# EAGLE design teclado_at_f340_smd_v2 (EAGLE 7.2.0)
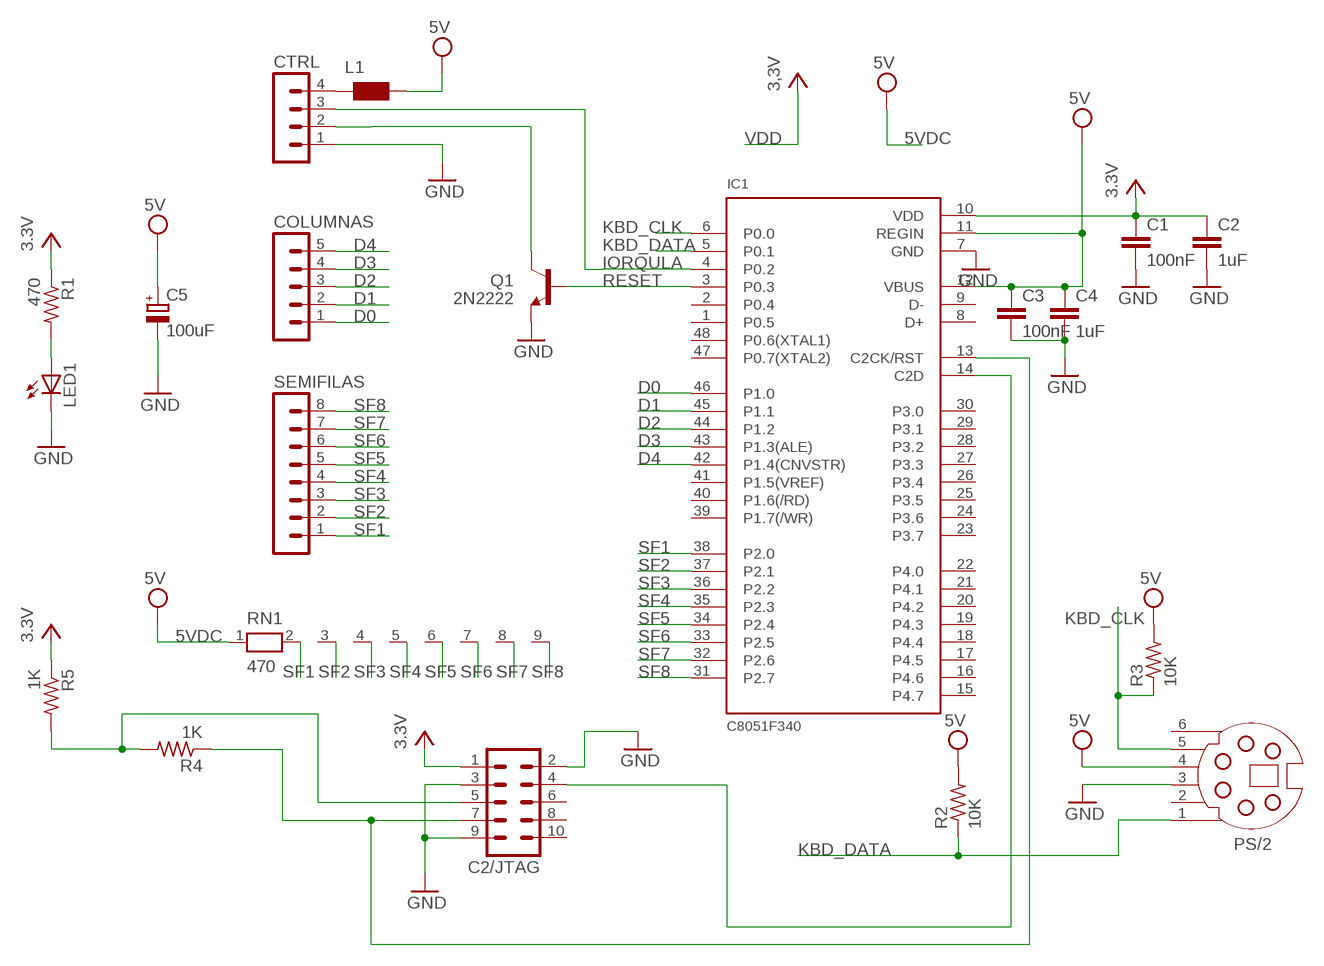
[diagram p0: schematic, sheet 1]

## Parts
C1  100nF  C-EUC0805K  [C0805K]
C2  1uF  C-EUC0805K  [C0805K]
C2/JTAG  MA05-2  [MA05-2]
C3  100nF  C-EUC0805K  [C0805K]
C4  1uF  C-EUC0805K  [C0805K]
C5  100uF  CPOL-EUE2,5-6E  [E2,5-6E]
COLUMNAS  MA05-1  [MA05-1]
CTRL  MA04-1  [MA04-1]
IC1  C8051F340  [TQFP48]
L1  WE-CBF_0805  [0805]
LED1  LEDCHIP-LED0805  [CHIP-LED0805]
PS/2  SSV-G06  [SSV-BC06]
Q1  2N2222  TRANSISTOR_NPNSOT23-3  [SOT23-3]
R1  470  R-US_M0805  [M0805]
R2  10K  R-US_M0805  [M0805]
R3  10K  R-US_M0805  [M0805]
R4  1K  R-US_M0805  [M0805]
R5  1K  R-US_M0805  [M0805]
RN1  470  RN08  [RN-9]
SEMIFILAS  MA08-1  [MA08-1]

## Nets
5VDC [power]: C3.1 C4.1 C5.+ IC1.11(REGIN) IC1.12(VBUS) L1.2 PS/2.4 R2.2 R3.2 RN1.1 ; supply symbol labelled 5V
D0: COLUMNAS.1 IC1.46(P1.0)
D1: COLUMNAS.2 IC1.45(P1.1)
D2: COLUMNAS.3 IC1.44(P1.2)
D3: COLUMNAS.4 IC1.43(P1.3(ALE))
D4: COLUMNAS.5 IC1.42(P1.4(CNVSTR))
GND [power]: C1.2 C2.2 C2/JTAG.2 C2/JTAG.3 C2/JTAG.9 C3.2 C4.2 C5.- CTRL.1 IC1.7(GND) LED1.C PS/2.3 Q1.2(E)
IORQULA: CTRL.3 IC1.4(P0.2)
KBD_CLK: IC1.6(P0.0) PS/2.5 R3.1
KBD_DATA: IC1.5(P0.1) PS/2.1 R2.1
N$1: C2/JTAG.7 IC1.13(C2CK/RST) R4.1
N$2: LED1.A R1.2
N$3: C2/JTAG.5 R4.2 R5.2
N$4: C2/JTAG.4 IC1.14(C2D)
N$5: CTRL.4 L1.1
N$7: CTRL.2 Q1.3(C)
RESET: IC1.3(P0.3) Q1.1(B)
SF1: IC1.38(P2.0) RN1.2 SEMIFILAS.1
SF2: IC1.37(P2.1) RN1.3 SEMIFILAS.2
SF3: IC1.36(P2.2) RN1.4 SEMIFILAS.3
SF4: IC1.35(P2.3) RN1.5 SEMIFILAS.4
SF5: IC1.34(P2.4) RN1.6 SEMIFILAS.5
SF6: IC1.33(P2.5) RN1.7 SEMIFILAS.6
SF7: IC1.32(P2.6) RN1.8 SEMIFILAS.7
SF8: IC1.31(P2.7) RN1.9 SEMIFILAS.8
VDD [power]: C1.1 C2.1 C2/JTAG.1 IC1.10(VDD) R1.1 R5.1 ; supply symbol labelled 3,3V, 3.3V
Unconnected: C2/JTAG.6 C2/JTAG.8 C2/JTAG.10 IC1.1(P0.5) IC1.2(P0.4) IC1.8(D+) IC1.9(D-) IC1.15(P4.7) IC1.16(P4.6) IC1.17(P4.5) IC1.18(P4.4) IC1.19(P4.3) IC1.20(P4.2) IC1.21(P4.1) IC1.22(P4.0) IC1.23(P3.7) IC1.24(P3.6) IC1.25(P3.5) IC1.26(P3.4) IC1.27(P3.3) IC1.28(P3.2) IC1.29(P3.1) IC1.30(P3.0) IC1.39(P1.7(/WR)) IC1.40(P1.6(/RD)) IC1.41(P1.5(VREF)) IC1.47(P0.7(XTAL2)) IC1.48(P0.6(XTAL1)) PS/2.2 PS/2.6

## Library data of the parts
C1-C4 = rcl:C-EU: CAPACITOR, European symbol
C2/JTAG = con-lstb:MA05-2: PIN HEADER
C5 = rcl:CPOL-EU: POLARIZED CAPACITOR, European symbol
COLUMNAS = con-lstb:MA05-1: PIN HEADER
CTRL = con-lstb:MA04-1: PIN HEADER
IC1 = silabs-2:C8051F340: Full Speed USB Flash MCU
L1 = wuerth-elektronik:WE-CBF: SMD EMI Suppression Ferrite Beads - excellent anti-EMI properties - low DCR - impedances till 3000 ohms - rated current up to 6 A
LED1 = adafruit:LED: LED OSRAM: - CHIPLED LG R971, LG N971, LY N971, LG Q971, LY Q971, LO R971, LY R971 LH N974, LH R974 LS Q976, LO Q976, LY Q976 LO Q996 - Hyper CHIPLED LW Q18S LB Q993, LB Q99A, LB R99A - SideLED LS A670, LO A670, LY A670, LG A670, LP A670 LB A673, LV A673, LT A673, LW A673 LH A674 LY A675 LS A676, LA A676, LO A676, LY A676, LW A676 LS A679, LY A679, LG A679 - Hyper Micro SIDELED® LS Y876, LA Y876, LO Y876, LY Y876 LT Y87S - SmartLED LW L88C, LW L88S LB L89C, LB L89S, LG L890 LS L89K, LO L89K, LY L89K LS L896, LA L896, LO L896, LY L896 - TOPLED LS T670, LO T670, LY T670, LG T670, LP T670 LSG T670, LSP T670, LSY T670, LOP T670, LYG T670 LG T671, LOG T671, LSG T671 LB T673, LV T673, LT T673, LW T673 LH T674 LS T676, LA T676, LO T676, LY T676, LB T676, LH T676, LSB T676, LW T676 LB T67C, LV T67C, LT T67C, LS T67K, LO T67K, LY T67K, LW E67C LS E67B, LA E67B, LO E67B, LY E67B, LB E67C, LV E67C, LT E67C LW T67C LS T679, LY T679, LG T679 LS T770, LO T770, LY T770, LG T770, LP T770 LB T773, LV T773, LT T773, LW T773 LH T774 LS E675, LA E675, LY E675, LS T675 LS T776, LA T776, LO T776, LY T776, LB T776 LHGB T686 LT T68C, LB T68C - Hyper Mini TOPLED® LB M676 - Mini TOPLED Santana® LG M470 LS M47K, LO M47K, LY M47K Source: http://www.osram.convergy.de/
PS/2 = con-yamaichi:SSV-G06: YAMAICHI CONNECTOR
Q1 = SparkFun:TRANSISTOR_NPN: Transistor NPN BJT configuration in SOT23 package. MMBT2222 is the common NPN we use. Double check BCE configuration again layout.
R1-R5 = rcl:R-US_: RESISTOR, American symbol
RN1 = resistor-net:RN08: RESISTOR NETWORK
SEMIFILAS = con-lstb:MA08-1: PIN HEADER

## Net classes
0 default: width 0.254 mm, clearance 0.254 mm
1 power: width 0.508 mm, clearance 0.254 mm to class 0, clearance 0.254 mm

## Board
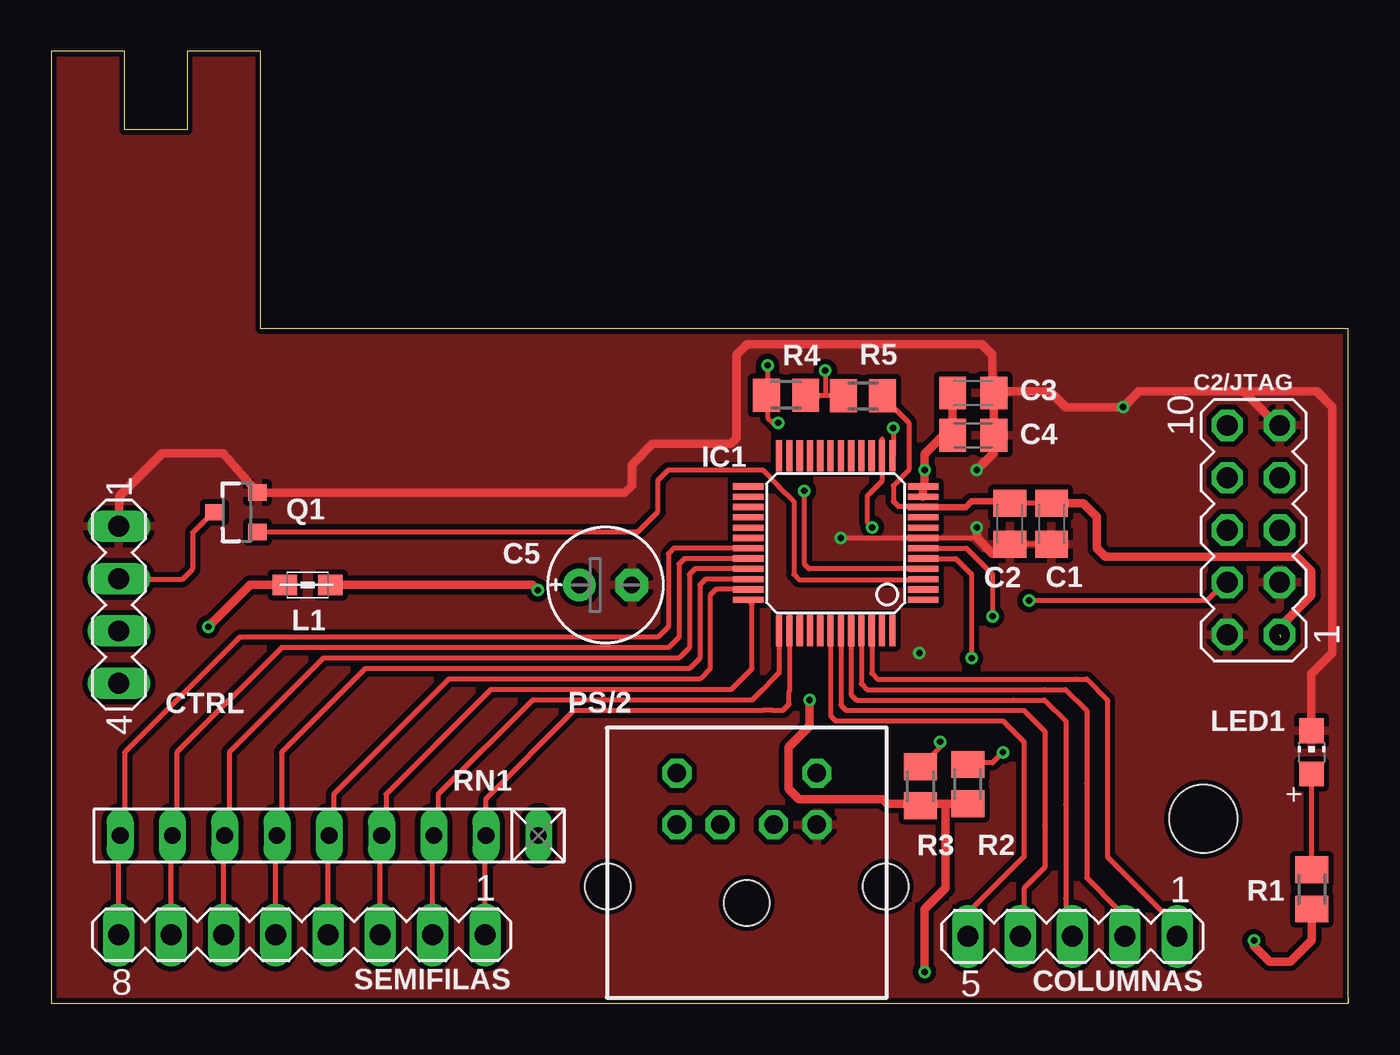
[diagram p1: board, top side]
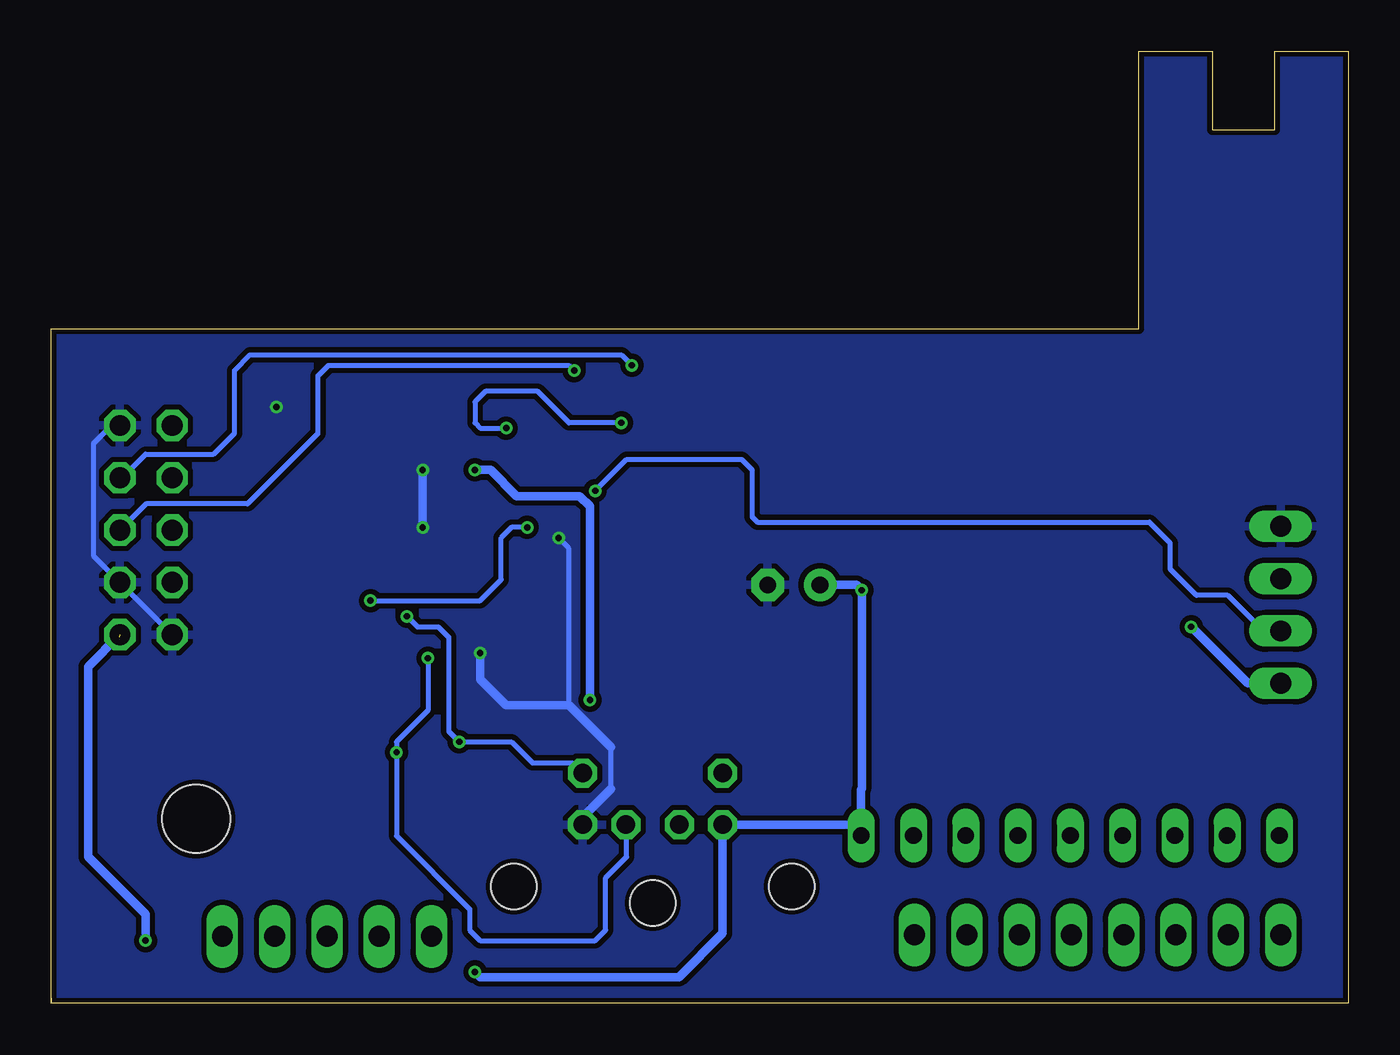
[diagram p2: board, bottom side, seen from below]

Size 62.99 x 46.23 mm. Coordinates in mm from the lower left corner, seen from the top.
Outline: 62.99,0.25 62.99,0
Outline: 62.99,0 62.99,0.25
Outline: 62.99,0.25 62.99,32.77 10.16,32.77 10.16,46.23 6.6,46.23 6.6,42.42 6.58,42.42 3.56,42.42 3.56,46.23 2.03,46.23 0,46.23 0,0 5.59,0 61.98,0 62.99,0
Copper layers (1*16): Top 0.035mm / dielectric 1.5mm / Bottom 0.035mm
Design rules "ITEADstudio_DRC": minimum track width 6mil, minimum drill 12mil, track to track 6mil, track to pad 6mil, pad to pad 6mil, via to via 6mil, smd to smd 0mil, copper to edge 10mil, drill to drill 10mil, minimum pad ring 10mil, minimum via ring 6mil, stop-mask expansion 2mil, vias tented up to drill 100mil, thermal gap 10mil
Holes 3.3 mm at 55.96,8.96

### Footprints (pad centres in the part's own frame; a part is rotated, then mirrored left to right if it is on the bottom)
C0805K = smd 1.3 x 1.6: 1 -1,0; 2 1,0
MA05-2 = drill 1.016 octagon: 1 -5.08,-1.27; 2 -5.08,1.27; 3 -2.54,-1.27; 4 -2.54,1.27; 5 0,-1.27; 6 0,1.27; 7 2.54,-1.27; 8 2.54,1.27; 9 5.08,-1.27; 10 5.08,1.27
E2,5-6E = drill 0.813 pad 1.575: + -1.27,0 | drill 0.813 pad 1.575 octagon: - 1.27,0
MA05-1 = drill 1.016 long: 1 -5.08,0; 2 -2.54,0; 3 0,0; 4 2.54,0; 5 5.08,0
MA04-1 = drill 1.016 long: 1 -3.81,0; 2 -1.27,0; 3 1.27,0; 4 3.81,0
TQFP48 = smd 0.3 x 1.5: 1 -2.75,-4.25; 2 -2.25,-4.25; 3 -1.75,-4.25; 4 -1.25,-4.25; 5 -0.75,-4.25; 6 -0.25,-4.25; 7 0.25,-4.25; 8 0.75,-4.25; 9 1.25,-4.25; 10 1.75,-4.25; 11 2.25,-4.25; 12 2.75,-4.25; 25 2.75,4.25; 26 2.25,4.25; 27 1.75,4.25; 28 1.25,4.25; 29 0.75,4.25; 30 0.25,4.25; 31 -0.25,4.25; 32 -0.75,4.25; 33 -1.25,4.25; 34 -1.75,4.25; 35 -2.25,4.25; 36 -2.75,4.25 | smd 1.5 x 0.3: 13 4.25,-2.75; 14 4.25,-2.25; 15 4.25,-1.75; 16 4.25,-1.25; 17 4.25,-0.75; 18 4.25,-0.25; 19 4.25,0.25; 20 4.25,0.75; 21 4.25,1.25; 22 4.25,1.75; 23 4.25,2.25; 24 4.25,2.75; 37 -4.25,2.75; 38 -4.25,2.25; 39 -4.25,1.75; 40 -4.25,1.25; 41 -4.25,0.75; 42 -4.25,0.25; 43 -4.25,-0.25; 44 -4.25,-0.75; 45 -4.25,-1.25; 46 -4.25,-1.75; 47 -4.25,-2.25; 48 -4.25,-2.75
0805 = smd 1.2 x 1: 1 -1.1,0; 2 1.1,0
CHIP-LED0805 = smd 1.2 x 1.2: A 0,-1.05; C 0,1.05
SSV-BC06 = drill 0.9 octagon: 1 1.3,8.5; 2 -1.3,8.5; 3 3.4,8.5; 4 -3.4,8.5; 5 3.4,11; 6 -3.4,11 | hole 2.2: -6.75,5.5; 0,4.7; 6.75,5.5
SOT23-3 = smd 0.8 x 0.9: 1 -0.95,-1; 2 0.95,-1; 3 0,1.1
M0805 = smd 1.3 x 1.6: 1 -0.95,0; 2 0.95,0
RN-9 = drill 0.813 long: 1 -10.16,0; 2 -7.62,0; 3 -5.08,0; 4 -2.54,0; 5 0,0; 6 2.54,0; 7 5.08,0; 8 7.62,0; 9 10.16,0
MA08-1 = drill 1.016 long: 1 -8.89,0; 2 -6.35,0; 3 -3.81,0; 4 -1.27,0; 5 1.27,0; 6 3.81,0; 7 6.35,0; 8 8.89,0

### Placement (x,y rotation side)
C1  48.59,23.29 270 top
C2  46.56,23.29 270 top
C2/JTAG  58.4,22.98 90 top
C3  44.78,29.64 0 top
C4  44.78,27.58 0 top
C5  26.92,20.32 0 top
COLUMNAS  49.61,3.25 180 top
CTRL  3.28,19.35 270 top
IC1  38.1,22.35 90 top
L1  12.45,20.32 0 top
LED1  61.21,12.19 0 top
PS/2  33.78,0.18 0 top
Q1  9.02,23.85 90 top
R1  61.23,5.54 90 top
R2  44.52,10.65 270 top
R3  42.23,10.54 270 top
R4  35.69,29.54 0 top
R5  39.42,29.5 180 top
RN1  13.49,8.15 180 top
SEMIFILAS  12.17,3.33 180 top

### Tracks (layer width: path | path; a pad name or v marks a point on that pad's centre or on a via)
5VDC  (via drill 0.3 pad 0.61)
  Top 0.254: 42.33,9.7 R3.2 | C4.1 43.33,27.58 | 42.42,25.17 IC1.12
  Top 0.406: R2.2 43.43,9.7 | 43.43,9.7 42.33,9.7 40.59,9.7 40.39,9.91 36.32,9.91 35.81,10.41 35.81,12.45 36.83,13.46 v36.83,14.73 | IC1.12 IC1.11 | C3.1 C4.1 | 43.33,27.58 42.42,26.67 v42.42,25.91 42.42,25.17 | v42.42,1.52 42.42,4.57 43.43,5.59 43.43,9.7 | L1.2 23.37,20.32 v23.62,20.07
  Bottom 0.254: 24.18,8.68 RN1.1
  Bottom 0.406: v42.42,1.52 42.16,1.27 32.51,1.27 30.38,3.4 PS/2.4 24.18,8.68 | RN1.1 23.65,10.38 23.62,10.41 v23.62,20.07 23.88,20.32 C5.+ | v36.83,14.73 36.83,24.13 37.34,24.64 40.39,24.64 41.66,25.91 v42.42,25.91
D0
  Top 0.254: COLUMNAS.1 54.36,3.58 54.36,4.06 53.85,4.57 51.31,7.11 51.31,11.68 51.31,14.73 50.29,15.75 49.78,15.75 40.13,15.75 39.85,16.03 IC1.46
D1
  Top 0.254: COLUMNAS.2 51.82,3.58 51.82,4.57 50.29,6.1 50.29,10.67 50.29,14.22 49.28,15.24 48.26,15.24 39.62,15.24 39.35,15.51 IC1.45
D2
  Top 0.254: COLUMNAS.3 49.28,3.58 49.28,5.08 49.28,9.65 49.28,13.72 48.26,14.73 46.74,14.73 39.12,14.73 38.85,15 IC1.44
D3
  Top 0.254: COLUMNAS.4 47.24,3.43 47.24,5.08 47.24,5.59 48.26,6.6 48.26,8.64 48.26,13.21 47.24,14.22 41.15,14.22 38.61,14.22 38.35,14.48 IC1.43
D4
  Top 0.254: 44.7,3.43 COLUMNAS.5 44.7,3.43 | IC1.42 37.85,13.97 38.1,13.72 40.64,13.72 46.23,13.72 47.24,12.7 47.24,7.11 44.7,4.57 44.7,3.43
GND  (via drill 0.3 pad 0.61)
  Top 0.254: C1.2 C2.2 46.5,21.84 45.72,21.84 | 44.96,22.61 44.96,22.6 IC1.7 v38.35,22.61 | 45.72,29.7 C3.2
  Top 0.406: CTRL.1 3.3,24.64 5.38,26.72 8.35,26.72 Q1.2 27.85,24.8 28.19,25.15 28.19,26.16 29.21,27.18 33.02,27.18 33.27,27.43 33.27,31.5 33.78,32 45.21,32 45.72,31.5 45.72,29.7 | 44.96,22.6 45.72,21.84 | v44.96,25.91 45.78,26.73 C4.2 C3.2 45.86,29.72 48.51,29.72 49.28,28.96 v52.07,28.96 52.83,29.72 57.91,29.72 58.04,29.59 | v44.96,23.11 44.96,22.61 | C2/JTAG.9 59.57,28.06 58.04,29.59 | LED1.C 61.21,16 62.23,17.02 62.23,28.96 61.47,29.72 58.17,29.72 58.04,29.59
  Bottom 0.254: C2/JTAG.2 C2/JTAG.3 60.96,21.74 60.96,27.18 60.07,28.06 C2/JTAG.9 | 35.81,10.41 35.81,12.45 | 37.85,14.48 37.85,22.1 v38.35,22.61
  Bottom 0.406: v44.96,25.91 v44.96,23.11 | PS/2.3 37.18,9.05 35.81,10.41 | 35.81,12.45 37.85,14.48 40.89,14.48 42.16,15.75 v42.16,17.02
  pour Top: 0,46.23 10.16,46.23 10.16,32.77 62.99,32.77 62.99,0 0,0
  pour Bottom: 0,46.23 10.16,46.23 10.16,32.77 62.99,32.77 62.99,0 0,0
IORQULA  (via drill 0.3 pad 0.61)
  Top 0.254: IC1.4 36.81,21.1 36.58,21.34 v36.58,24.89
  Bottom 0.254: v36.58,24.89 35.05,26.42 29.46,26.42 28.96,25.91 28.96,23.62 28.7,23.37 9.65,23.37 8.64,22.35 8.64,21.08 7.37,19.81 5.84,19.81 4.12,18.09 CTRL.3 3.33,18.03
KBD_CLK  (via drill 0.3 pad 0.61)
  Top 0.254: 42.03,11.68 R3.1 43.18,12.45 v43.18,12.7 | IC1.6 44.45,22.1 45.72,20.83 v45.72,18.8
  Bottom 0.254: v45.72,18.8 45.21,18.29 44.2,18.29 43.69,17.78 43.69,13.21 v43.18,12.7 40.64,12.7 39.62,11.68 37.69,11.68 PS/2.5
KBD_DATA  (via drill 0.3 pad 0.61)
  Top 0.254: IC1.5 43.93,21.6 44.7,20.83 v44.7,16.76 | v46.23,12.19 45.72,11.68 44.6,11.68 R2.1
  Bottom 0.254: v44.7,16.76 44.7,14.22 46.23,12.7 | 46.23,12.7 v46.23,12.19 | v46.23,12.19 46.23,8.13 42.67,4.57 42.67,3.56 42.16,3.05 36.58,3.05 36.07,3.56 36.07,6.1 35.05,7.11 35.05,8.65 PS/2.1 | 46.23,12.7 v46.23,12.19
N$1  (via drill 0.3 pad 0.61)
  Top 0.254: v34.8,30.99 34.8,29.6 | 34.8,29.6 R4.1 | 34.8,29.6 34.8,28.45 35.05,28.19 v35.31,28.19 | v40.89,27.94 40.89,26.65 IC1.13
  Bottom 0.254: C2/JTAG.7 59.57,25.52 58.42,26.67 55.12,26.67 54.1,27.69 54.1,30.73 53.34,31.5 35.31,31.5 v34.8,30.99 | v35.31,28.19 37.85,28.19 39.37,29.72 41.91,29.72 42.42,29.21 42.42,28.19 42.16,27.94 v40.89,27.94
N$2
  Top 0.254: LED1.A 61.21,7.77 R1.2
N$3  (via drill 0.3 pad 0.61)
  Top 0.254: R4.2 37.59,29.54 | 37.59,29.54 38.43,29.54 R5.2 | v37.59,30.73 37.59,29.54
  Bottom 0.254: v37.59,30.73 37.85,30.99 49.53,30.99 50.04,30.48 50.04,27.69 53.47,24.26 58.39,24.26 C2/JTAG.5
N$4  (via drill 0.3 pad 0.61)
  Top 0.254: C2/JTAG.4 57.02,20.44 56.13,19.56 v47.5,19.56 | IC1.14 40.35,27.42 40.34,27.18 40.34,25.35 39.62,24.64 39.62,23.62 39.62,23.37 v39.88,23.11
  Bottom 0.254: v47.5,19.56 42.16,19.56 41.15,20.57 41.15,22.61 40.64,23.11 v39.88,23.11
N$5  (via drill 0.3 pad 0.61)
  Top 0.406: v7.62,18.29 9.65,20.32 L1.1
  Bottom 0.406: CTRL.4 4.88,15.54 v7.62,18.29
N$7
  Top 0.254: Q1.3 7.85,23.85 6.86,22.86 6.86,21.08 6.35,20.57 3.33,20.57 CTRL.2
RESET
  Top 0.254: Q1.1 28.49,22.9 29.46,23.88 29.46,25.4 29.97,25.91 34.54,25.91 35.31,25.15 36.07,24.38 36.07,20.83 36.32,20.57 42.32,20.57 IC1.3
SF1
  Top 0.254: SEMIFILAS.1 21.06,8.09 RN1.2 21.11,9.94 25.4,14.22 34.54,14.22 35.05,14.22 35.53,14.22 35.84,14.53 35.84,15.13 35.85,15.15 IC1.38
SF2
  Top 0.254: SEMIFILAS.2 18.52,8.09 RN1.3 18.8,8.37 18.8,10.16 23.37,14.73 34.04,14.73 34.54,15.24 35.11,15.81 35.35,16.05 IC1.37
SF3
  Top 0.254: SEMIFILAS.3 15.98,8.09 RN1.4 16.26,8.37 16.26,10.16 21.34,15.24 33.02,15.24 33.62,15.84 34.04,16.26 34.04,19.42 IC1.36
SF4
  Top 0.254: SEMIFILAS.4 13.44,8.09 RN1.5 13.72,8.37 13.72,10.16 19.3,15.75 27.43,15.75 31.5,15.75 32,16.26 32,19.81 32.29,20.1 IC1.35
SF5
  Top 0.254: SEMIFILAS.5 10.9,8.09 RN1.6 11.18,8.37 11.18,12.19 15.24,16.26 26.92,16.26 30.99,16.26 31.5,16.76 31.5,20.32 31.78,20.6 IC1.34
SF6
  Top 0.254: SEMIFILAS.6 8.36,8.09 RN1.7 8.64,8.37 8.64,12.19 13.21,16.76 26.42,16.76 30.48,16.76 30.99,17.27 30.99,20.83 31.26,21.1 IC1.33
SF7
  Top 0.254: SEMIFILAS.7 5.82,8.09 RN1.8 6.1,8.37 6.1,12.19 11.18,17.27 25.91,17.27 29.97,17.27 30.48,17.78 30.48,21.34 30.75,21.6 IC1.32
SF8
  Top 0.254: SEMIFILAS.8 3.28,8.09 RN1.9 3.56,8.37 3.56,12.19 9.14,17.78 29.46,17.78 29.97,18.29 29.97,21.84 30.23,22.1 IC1.31
VDD  (via drill 0.3 pad 0.61)  (1 unrouted)
  Top 0.254: C1.1 C2.1 | R5.1 40.37,29.48 41.66,28.19 41.66,25.91 40.89,25.15 40.89,24.38 41.15,24.13 42.32,24.13 IC1.10
  Top 0.305: IC1.10 44.42,24.1 44.7,24.38 46.47,24.38 C2.1
  Top 0.406: 59.69,17.78 59.69,18.29 61.21,19.81 61.21,20.98 60.5,21.69 51.21,21.69 50.8,22.1 50.8,23.62 50.13,24.29 C1.1 | R1.1 61.23,3.06 60.2,2.03 59.18,2.03 58.42,2.79 v58.42,3.05
  Bottom 0.406: v58.42,3.05 58.42,4.32 61.21,7.11 61.21,16.36 C2/JTAG.1

### Text on the board
tDocu: FAILSAFE | PS/2 internal adapter / (C)2006-2015 McLeod/IdeaFix / http://www.zxprojects.com